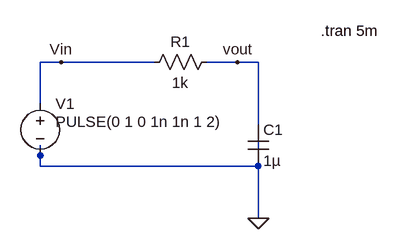
[diagram p0: schematic Draft1.asc]
Draft1.asc, the LTspice schematic file:
Version 4
SHEET 1 880 680
WIRE 32 128 0 128
WIRE 176 128 32 128
WIRE 304 128 256 128
WIRE 336 128 304 128
WIRE 0 192 0 128
WIRE 336 224 336 128
WIRE 0 272 0 256
WIRE 0 288 0 272
WIRE 336 288 336 240
WIRE 336 288 0 288
WIRE 336 368 336 288
FLAG 336 368 0
FLAG 304 128 vout
FLAG 32 128 Vin
SYMBOL res 272 112 R90
WINDOW 0 0 56 VBottom 2
WINDOW 3 32 56 VTop 2
SYMATTR InstName R1
SYMATTR Value 1k
SYMBOL cap 320 224 R0
SYMATTR InstName C1
SYMATTR Value 1µ
SYMBOL voltage 0 176 R0
WINDOW 3 24 44 Left 2
WINDOW 123 0 0 Left 0
WINDOW 39 0 0 Left 0
SYMATTR InstName V1
SYMATTR Value PULSE(0 1 0 1n 1n 1 2)
TEXT 432 80 Left 2 !.tran 5m

The netlist it stands for:
* Draft1.asc
R1 vout Vin 1k
C1 vout 0 1µ
V1 Vin 0 PULSE(0 1 0 1n 1n 1 2)
.tran 5m
.backanno
.end

* Results of the author's LTspice run, read from the files saved beside the schematic
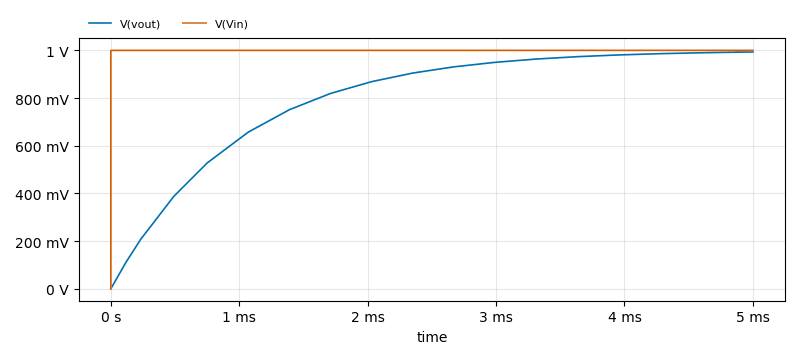
[diagram p1: Transient Analysis of Draft1.asc, plotted from the saved traces]
* Transient Analysis, 1 run:
*   V(vout): min 0 V, max 993.3 mV, average 800.2 mV, rms 837.9 mV, last 993.3 mV
*   V(Vin): min 0 V, max 1 V, average 1 V, rms 1 V, last 1 V